# Altium schematic sheet zmena polarity_BDD_2.SchDoc
size A0
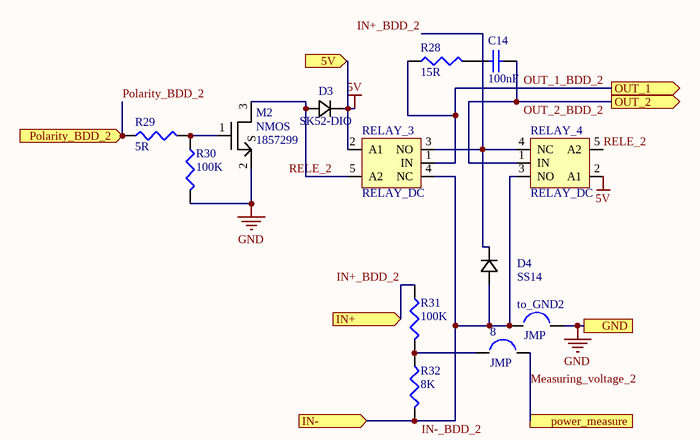
[diagram p0: zmena polarity_BDD_2.SchDoc]

## Parts
8  JMP  [JMP]
C14  100nF  [1608[0603]]
D3  SK52-DIO  [D5A20V]
D4  SS14  [D5A20V]
M2  NMOS  Supplier Part Number 1: 1857299  [SOT23]
R28  15R  [J1-0603]
R29  5R  [J1-0603]
R30  100K  [J1-0603]
R31  100K  [J1-0603]
R32  8K  [J1-0603]
RELAY_3  RELAY_DC  [RELAY_DC]
RELAY_4  RELAY_DC  [RELAY_DC]
to_GND2  JMP  [JMP]

## Ports
5V (in), GND, IN+ (in), IN- (in), OUT_1 (out), OUT_2 (out), Polarity_BDD_2 (in), power_measure

## Nets
5V: D3.1 RELAY_3.2(A1) RELAY_4.2(A1) ; port 5V
GND: M2.2(S) R30.2 to_GND2.2 ; port GND
IN+_BDD_2: D4.1 R31.1 RELAY_3.3(NO) RELAY_4.4(NC) ; port IN+
IN-_BDD_2: D4.2 R32.2 RELAY_3.4(NC) RELAY_4.3(NO) to_GND2.1 ; port IN-
Measuring_voltage_2: 8.2 ; port power_measure
OUT_1_BDD_2: R28.1 RELAY_3.1(IN) ; port OUT_1
OUT_2_BDD_2: C14.2 RELAY_4.1(IN) ; port OUT_2
Polarity_BDD_2: R29.1 ; port Polarity_BDD_2
RELE_2: D3.2 M2.3(D) RELAY_3.5(A2) RELAY_4.5(A2)
Net8_1: 8.1 R31.2 R32.1
NetC14_1: C14.1 R28.2
NetM2_1: M2.1(G) R29.2 R30.1

## Library data of the parts
C14 = Cap Semi: Capacitor (Semiconductor SIM Model); Value: 100pF; Published: 8-Jun-2000; LatestRevisionDate: 29-May-2009; LatestRevisionNote: IPC-7351 Footprint Added.; PackageReference: C1206; Publisher: Altium Limited; PackageDescription: Chip Capacitor
D3 D4 = D_5A_20V
R28 = Res3: Resistor; Value: 2R; Published: 8-Jun-2000; LatestRevisionDate: 29-May-2009; LatestRevisionNote: IPC-7351 Footprint Added.; PackageReference: J1-0603; Publisher: Altium Limited; PackageDescription: Chip Resistor
R29-R32 = Res3: Resistor; Value: 200K; Published: 8-Jun-2000; LatestRevisionDate: 29-May-2009; LatestRevisionNote: IPC-7351 Footprint Added.; PackageReference: J1-0603; Publisher: Altium Limited; PackageDescription: Chip Resistor
RELAY_3 RELAY_4 = RELAY_DC: RM51-3011-85-1005
M2 = NMOS: Supplier 1: Farnell